# EAGLE schematic new-mainboard (EAGLE 9.5.2)
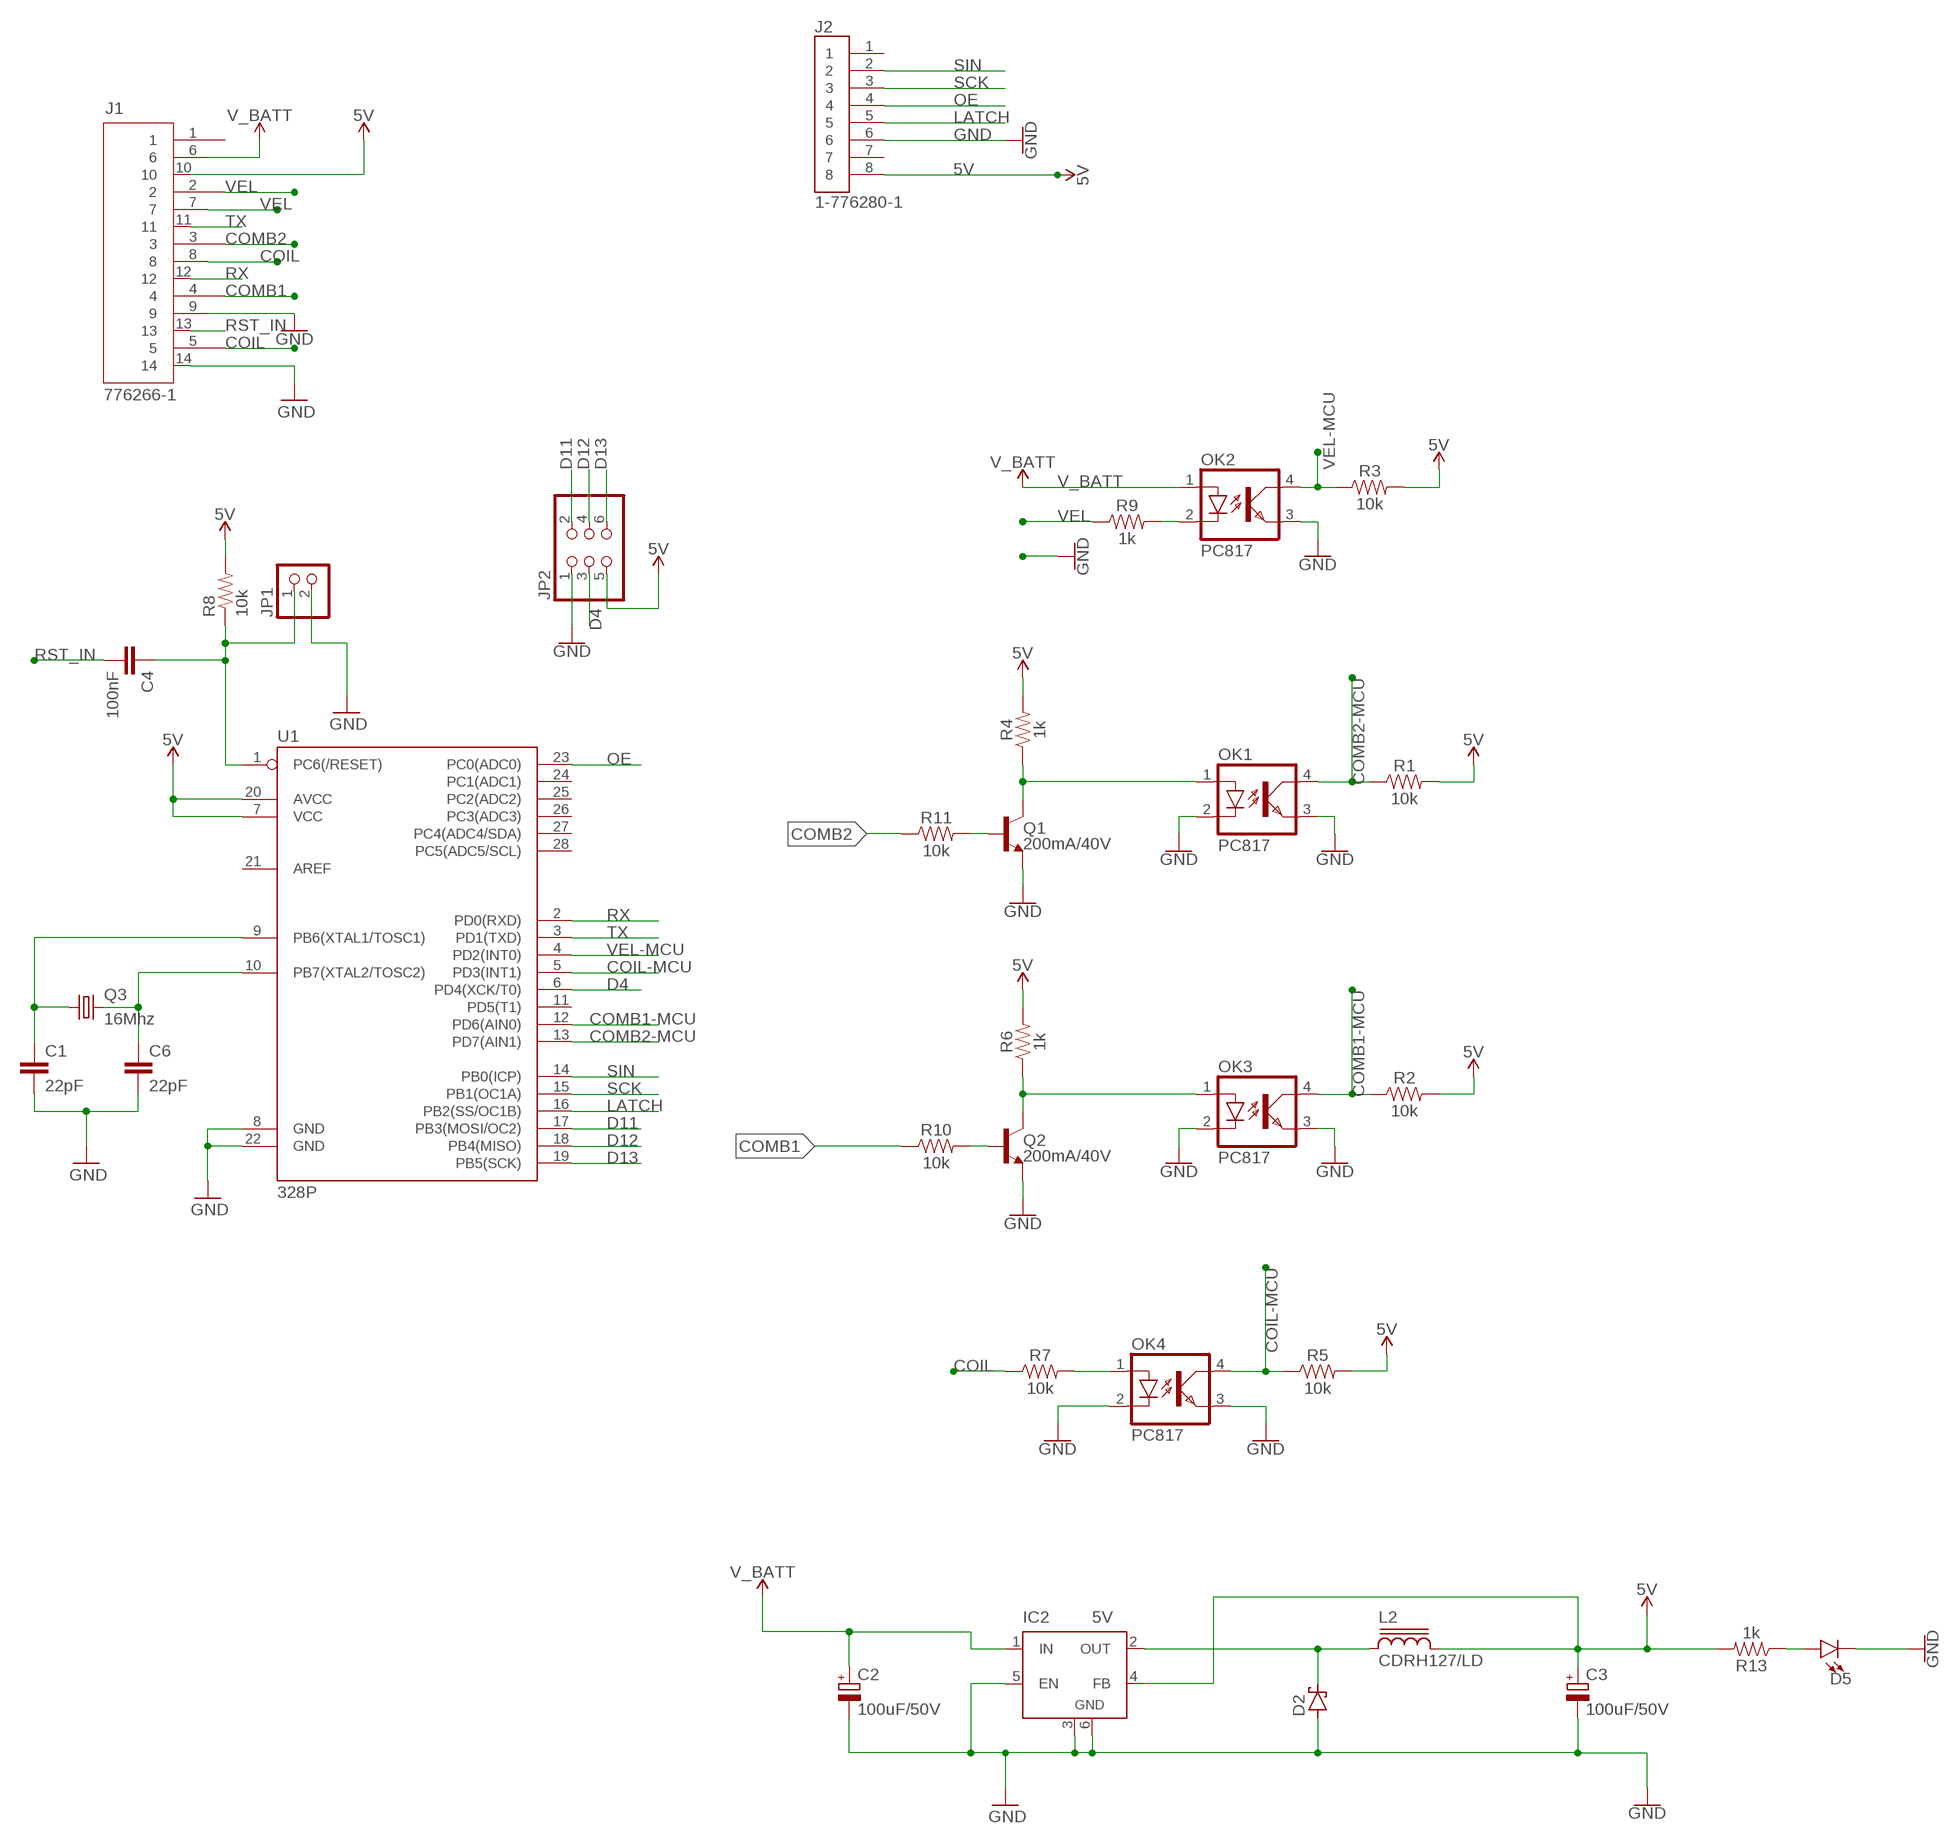
[diagram p0: schematic, sheet 1]

## Parts
C1  22pF  22PF-PTH-2.54MM-200V-5%  [CAP-PTH-2.54]
C2  100uF/50V  CPOL-EUE3.5-8  [E3,5-8]
C3  100uF/50V  CPOL-EUE3.5-8  [E3,5-8]
C4  100nF  22PF-PTH-2.54MM-200V-5%  [CAP-PTH-2.54]
C6  22pF  22PF-PTH-2.54MM-200V-5%  [CAP-PTH-2.54]
D2  SCHOTTKY-DIODESMD  [SMB]
D5  LED3MM  [LED_3MM]
IC2  5V  LM2596S  [TO263-5]
J1  776266-1  [TE_776266-1]
J2  1-776280-1  [TE_1-776280-1]
JP1  PINHD-1X2  [1X02]
JP2  PINHD-2X3  [2X03]
L2  CDRH127/LD  [CDRH127/LD]
OK1  PC817  [DIL04]
OK2  PC817  [DIL04]
OK3  PC817  [DIL04]
OK4  PC817  [DIL04]
Q1  200mA/40V  TRANS_NPN-2N3904  [TO-92]
Q2  200mA/40V  TRANS_NPN-2N3904  [TO-92]
Q3  16Mhz  CRYSTALHC49U-V  [HC49U-V]
R1  10k  10KOHM-HORIZ-1/4W-5%  [AXIAL-0.3]
R2  10k  10KOHM-HORIZ-1/4W-5%  [AXIAL-0.3]
R3  10k  10KOHM-HORIZ-1/4W-5%  [AXIAL-0.3]
R4  1k  1KOHM-HORIZ-1/4W-5%  [AXIAL-0.3]
R5  10k  10KOHM-HORIZ-1/4W-5%  [AXIAL-0.3]
R6  1k  1KOHM-HORIZ-1/4W-5%  [AXIAL-0.3]
R7  10k  10KOHM-HORIZ-1/4W-5%  [AXIAL-0.3]
R8  10k  10KOHM-HORIZ-1/4W-5%  [AXIAL-0.3]
R9  1k  1KOHM-HORIZ-1/4W-5%  [AXIAL-0.3]
R10  10k  10KOHM-HORIZ-1/4W-5%  [AXIAL-0.3]
R11  10k  10KOHM-HORIZ-1/4W-5%  [AXIAL-0.3]
R13  1k  1KOHM-HORIZ-1/4W-5%  [AXIAL-0.3]
U1  328P  ATMEGA328P_PDIP  [DIP28]

## Nets
5V: C3.+ IC2.4(FB) J1.10 J2.8 JP2.5 L2.2 R1.P$2 R2.P$2 R3.P$2 R4.P$2 R5.P$2 R6.P$2 R8.P$2 R13.P$2 U1.7(VCC) U1.20(AVCC)
COIL: J1.5 J1.8 R7.P$1
COIL-MCU: OK4.4(COL) R5.P$1 U1.5(PD3(INT1))
COMB1: J1.4 R10.P$1
COMB1-MCU: OK3.4(COL) R2.P$1 U1.12(PD6(AIN0))
COMB2: J1.3 R11.P$1
COMB2-MCU: OK1.4(COL) R1.P$1 U1.13(PD7(AIN1))
D4: JP2.3 U1.6(PD4(XCK/T0))
D11: JP2.2 U1.17(PB3(MOSI/OC2))
D12: JP2.4 U1.18(PB4(MISO))
D13: JP2.6 U1.19(PB5(SCK))
GND: C1.2 C2.- C3.- C6.2 D2.A D5.K(C) IC2.3(GND) IC2.5(EN) IC2.6(GND) J1.9 J1.14 J2.6 JP1.2 JP2.1 OK1.2(C) OK1.3(EMIT) OK2.3(EMIT) OK3.2(C) OK3.3(EMIT) OK4.2(C) OK4.3(EMIT) Q1.1(E) Q2.1(E) U1.8(GND) U1.22(GND)
LATCH: J2.5 U1.16(PB2(SS/OC1B))
N$1: OK4.1(A) R7.P$2
N$2: OK2.2(C) R9.P$2
N$3: OK1.1(A) Q1.3(C) R4.P$1
N$4: OK3.1(A) Q2.3(C) R6.P$1
N$5: C1.1 Q3.1 U1.9(PB6(XTAL1/TOSC1))
N$6: C6.1 Q3.2 U1.10(PB7(XTAL2/TOSC2))
N$7: Q2.2(B) R10.P$2
N$8: D5.A R13.P$1
N$9: Q1.2(B) R11.P$2
OE: J2.4 U1.23(PC0(ADC0))
OUT: D2.C IC2.2(OUT) L2.1
RST: C4.1 JP1.1 R8.P$1 U1.1(PC6(/RESET))
RST_IN: C4.2 J1.13
RX: J1.12 U1.2(PD0(RXD))
SCK: J2.3 U1.15(PB1(OC1A))
SIN: J2.2 U1.14(PB0(ICP))
TX: J1.11 U1.3(PD1(TXD))
V_BATT: C2.+ IC2.1(IN) J1.6 OK2.1(A)
VEL: J1.2 J1.7 R9.P$1
VEL-MCU: OK2.4(COL) R3.P$1 U1.4(PD2(INT0))
Unconnected: J1.1 J2.1 J2.7 U1.11(PD5(T1)) U1.21(AREF) U1.24(PC1(ADC1)) U1.25(PC2(ADC2)) U1.26(PC3(ADC3)) U1.27(PC4(ADC4/SDA)) U1.28(PC5(ADC5/SCL))

## Library data of the parts
C1 C6 = SparkFun-Capacitors:22PF: 22pF ceramic capacitors A capacitor is a passive two-terminal electrical component used to store electrical energy temporarily in an electric field.; PROD_ID: CAP-09128
C2 C3 = rcl:CPOL-EU: POLARIZED CAPACITOR, European symbol; SPICEPREFIX: C
C4 = SparkFun-Capacitors:22PF: 22pF ceramic capacitors A capacitor is a passive two-terminal electrical component used to store electrical energy temporarily in an electric field.; PROD_ID: CAP-09128; VALUE: 22pF
D2 = diode:SCHOTTKY-DIODE: Schottky Diode
D5 = SparkFun-LED:LED: LED (Generic) Standard schematic elements and footprints for 5mm, 3mm, 1206, and 0603 sized LEDs. Generic LEDs with no color specified.; PROD_ID: DIO-08794
IC2 = linear:LM2596S: STEP-DOWN VOLTAGE REGULATOR
J1 = 776266-1:776266-1: 14 POS RIGHT ANGLE HEADER ASSY; MANUFACTURER: TE CONNECTIVITY; PARTREV: B7; STANDARD: MANUFACTURER RECOMMENDATIONS
J2 = 1-776280-1:1-776280-1: 8 POS RTANG HDR ASSY W/GASKET; MANUFACTURER: TE Connectivity; METADATA: Manufacturer recommendations; PARTREV: F8
JP1 = pinhead:PINHD-1X2: PIN HEADER
JP2 = pinhead:PINHD-2X3: PIN HEADER
L2 = inductor-sumida:CDRH127/LD: Power Inductor
OK1-OK4 = optocoupler:PC817: SHARP OPTO COUPLER; MPN: PC817X4J000F; OC_FARNELL: 9707727; OC_NEWARK: 97K7059
Q1 Q2 = SparkFun-DiscreteSemi:TRANS_NPN: NPN transistor Current controlled devices typically used to amplify current or used as a switch. BC547 - COM-08928 <http://www.sparkfun.com/products/8928> (TO-92 45V 100mA) (1.Collector 2.Base 3.Emitter) 2N3904 - COM-00521 <http://www.sparkfun.com/products/521> (TO-92 40V 200mA) (1.Emitter 2.Base 3.Collector) P2N2222A - COM-12852 <http://www.sparkfun.com/products/12852> (TO-92 40V 600mA) (1.Collector 2.Base 3.Emitter); PROD_ID: TRANS-08447
Q3 = adafruit:CRYSTAL: CRYSTAL; OC_FARNELL: 1666969; OC_NEWARK: unknown
R1-R3 R5 R7 R8 R10 R11 = SparkFun-Resistors:10KOHM: 10kΩ resistor A resistor is a passive two-terminal electrical component that implements electrical resistance as a circuit element. Resistors act to reduce current flow, and, at the same time, act to lower voltage levels within circuits. - Wikipedia; PROD_ID: RES-09435
R4 R6 R9 R13 = SparkFun-Resistors:1KOHM: 1kΩ resistor A resistor is a passive two-terminal electrical component that implements electrical resistance as a circuit element. Resistors act to reduce current flow, and, at the same time, act to lower voltage levels within circuits. - Wikipedia; PROD_ID: RES-08380
U1 = SparkFun-IC-Microcontroller:ATMEGA328P_PDIP: Atmel 328P Through hole ATMEGA328P uC used in the Arduino 32kb flash, 1k EEPROM, 2k SRAM Datasheet <http://www.sparkfun.com/datasheets/Components/SMD/ATMega328.pdf> SparkFun Products Storefront component: AVR 28 Pin 20MHz 32K 6A/D - ATMega328P <https://www.sparkfun.com/products/9061> (COM-09061) SparkFun Simon Says - Through-Hole Soldering Kit <https://www.sparkfun.com/products/10547> (KIT-10547) SparkFun Learn to Solder - Simon Says <https://www.sparkfun.com/products/13708> (KIT-13708) SparkFun BigTime Watch Kit <https://www.sparkfun.com/products/11734> (KIT-11734) SparkFun ClockIt <https://www.sparkfun.com/products/10930> (KIT-10930) SparkFun Serial Enabled LCD Kit <https://www.sparkfun.com/products/10097> (LCD-10097) SparkFun Simon Tilts - Through Hole Soldering Kit <https://www.sparkfun.com/products/12634> (KIT-12634) SparkFun Frequency Counter Kit <https://www.sparkfun.com/products/10140> (KIT-10140) FabFM Radio Kit <https://www.sparkfun.com/products/11043> (KIT-11043) SparkFun Binary Blaster Kit <https://www.sparkfun.com/products/12037> (KIT-12037) SparkFun Metro-Gnome <https://www.sparkfun.com/products/9236> (KIT-09236) ATmega328 with Arduino Optiboot (Uno) <https://www.sparkfun.com/products/10524> (DEV-10524); PROD_ID: IC-09136

## Net classes
0 default: width 0.125 mm